# EAGLE design outdoor (EAGLE 9.1.3)
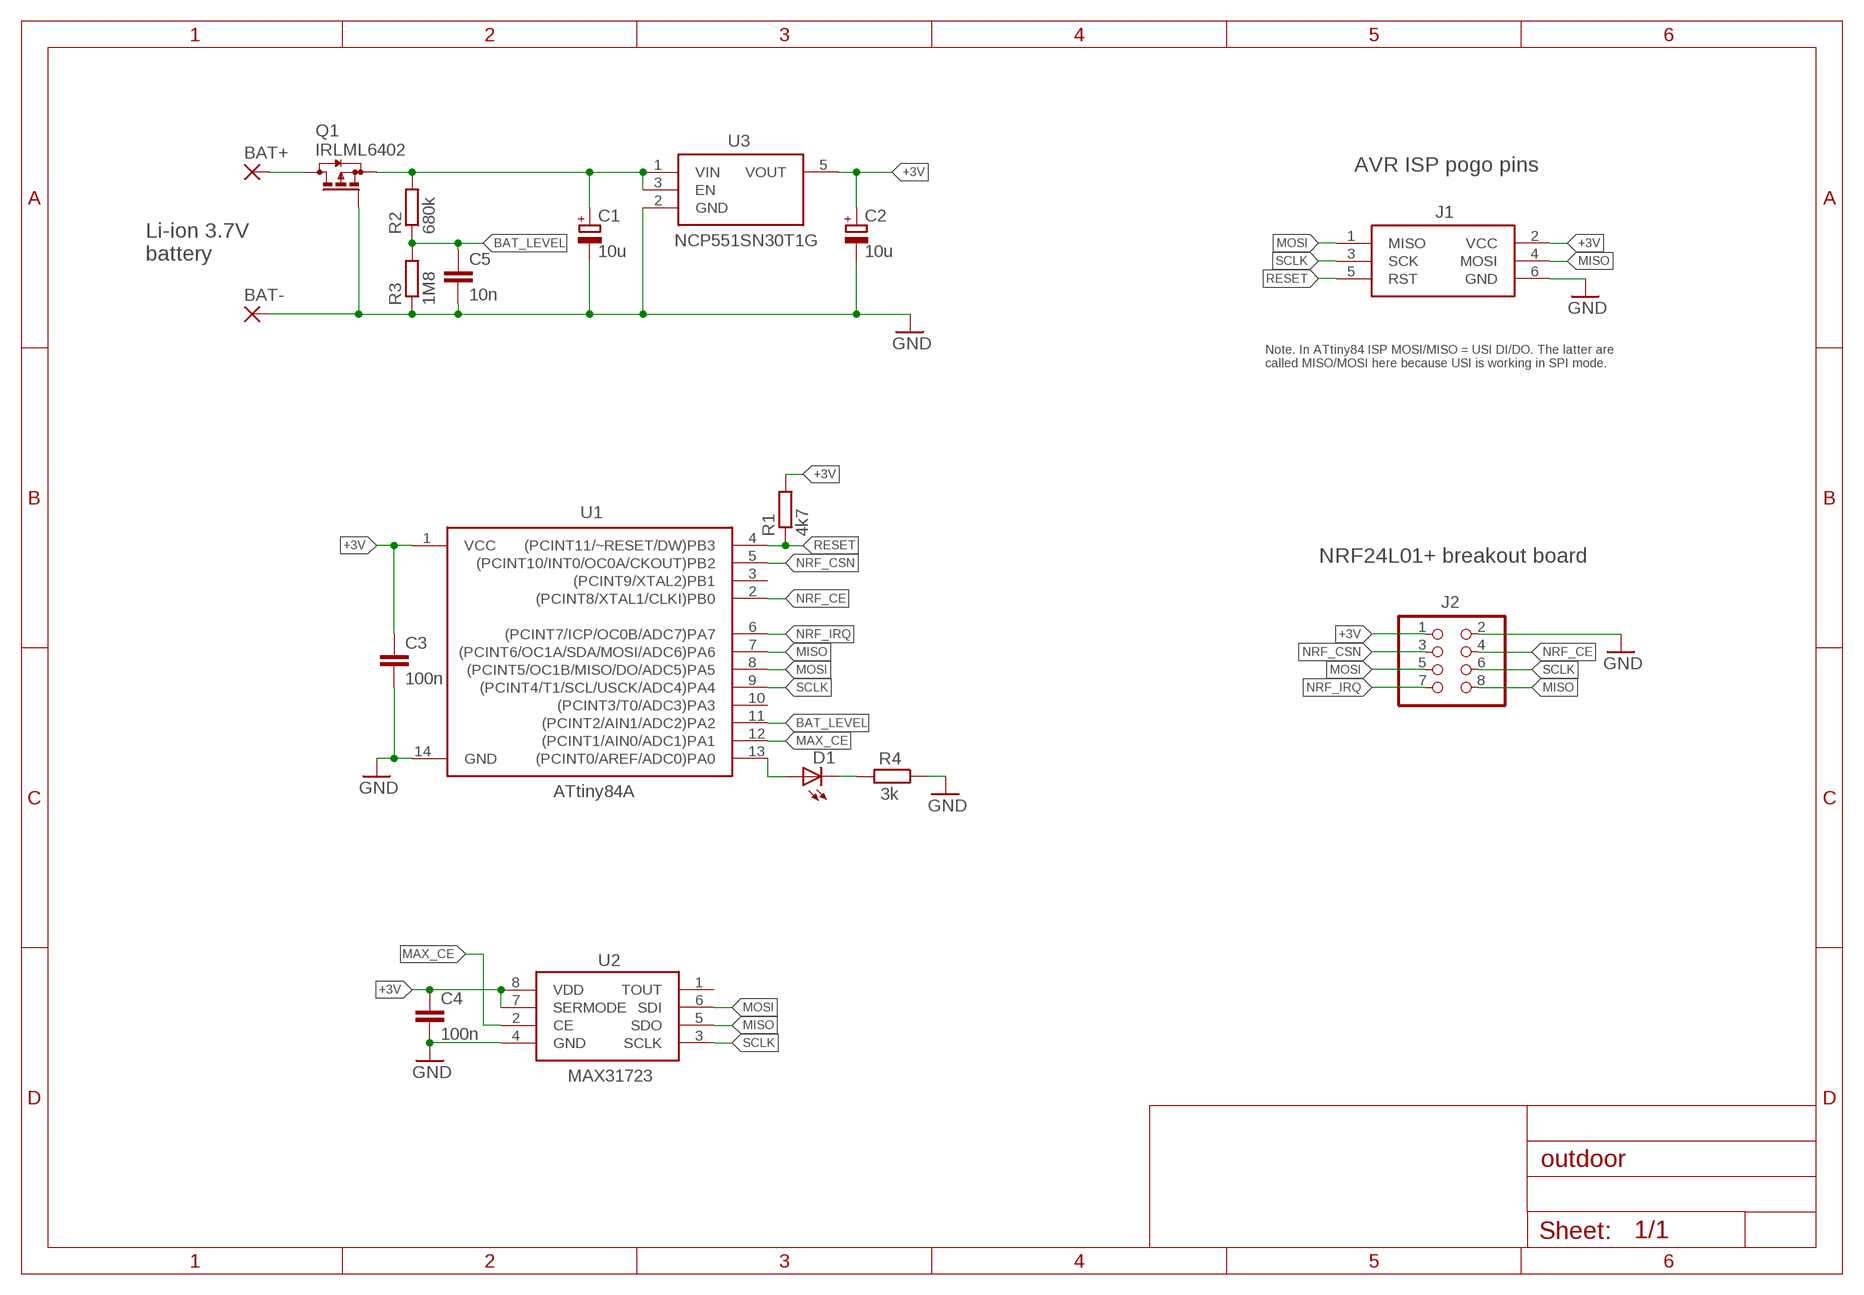
[diagram p0: schematic, sheet 1]

## Parts
BAT+  2,54/1,0  [2,54/1,0]
BAT-  2,54/1,0  [2,54/1,0]
C1  10u  CPOL-EUCT3216  [CT3216]
C2  10u  CPOL-EUCT3216  [CT3216]
C3  100n  C-EUC0805  [C0805]
C4  100n  C-EUC0805  [C0805]
C5  10n  C-EUC0805  [C0805]
D1  LEDSMT1206  [1206]
J1  POGO_AVR_ISP6  [POGO_AVR_ISP6]
J2  PINHD-2X4  [2X04]
Q1  IRLML6402  BSS84  [SOT23]
R1  4k7  R-EU_R0805  [R0805]
R2  680k  R-EU_R0805  [R0805]
R3  1M8  R-EU_R0805  [R0805]
R4  3k  R-EU_R0805  [R0805]
U1  ATtiny84A  ATTINY84  [SO14]
U2  MAX31723  MAX31722  [UMAX8]
U3  NCP551SN30T1G  NCP551  [SOT23-5]

## Nets
+3V: C2.+ C3.1 C4.1 J1.2(VCC) J2.1 R1.2 U1.1(VCC) U2.7(SERMODE) U2.8(VDD) U3.5(VOUT)
BAT_LEVEL: C5.1 R2.1 R3.2 U1.11((PCINT2/AIN1/ADC2)PA2)
GND: BAT-.1(P) C1.- C2.- C3.2 C4.2 C5.2 J1.6(GND) J2.2 Q1.1(G) R3.1 R4.1 U1.14(GND) U2.4(GND) U3.2(GND)
MAX_CE: U1.12((PCINT1/AIN0/ADC1)PA1) U2.2(CE)
MISO: J1.4(MOSI) J2.8 U1.7((PCINT6/OC1A/SDA/MOSI/ADC6)PA6) U2.5(SDO)
MOSI: J1.1(MISO) J2.5 U1.8((PCINT5/OC1B/MISO/DO/ADC5)PA5) U2.6(SDI)
N$1: BAT+.1(P) Q1.3(D)
N$2: C1.+ Q1.2(S) R2.2 U3.1(VIN) U3.3(EN)
N$3: D1.A U1.13((PCINT0/AREF/ADC0)PA0)
N$4: D1.C R4.2
NRF_CE: J2.4 U1.2((PCINT8/XTAL1/CLKI)PB0)
NRF_CSN: J2.3 U1.5((PCINT10/INT0/OC0A/CKOUT)PB2)
NRF_IRQ: J2.7 U1.6((PCINT7/ICP/OC0B/ADC7)PA7)
RESET: J1.5(RST) R1.1 U1.4((PCINT11/~RESET/DW)PB3)
SCLK: J1.3(SCK) J2.6 U1.9((PCINT4/T1/SCL/USCK/ADC4)PA4) U2.3(SCLK)
Unconnected: U1.3((PCINT9/XTAL2)PB1) U1.10((PCINT3/T0/ADC3)PA3) U2.1(TOUT)

## Notes on the sheet
- AVR ISP pogo pins
- Li-ion 3.7V
  battery
- Note. In ATtiny84 ISP MOSI/MISO = USI DI/DO. The latter are
  called MISO/MOSI here because USI is working in SPI mode.
- NRF24L01+ breakout board

## Library data of the parts
BAT+ BAT- = wirepad:2,54/1,0: THROUGH-HOLE PAD
C1 C2 = rcl:CPOL-EU: POLARIZED CAPACITOR, European symbol; SPICEPREFIX: C
C3-C5 = rcl:C-EU: CAPACITOR, European symbol; SPICEPREFIX: C
D1 = led:LED: LED OSRAM: - CHIPLED LG R971, LG N971, LY N971, LG Q971, LY Q971, LO R971, LY R971 LH N974, LH R974 LS Q976, LO Q976, LY Q976 LO Q996 - Hyper CHIPLED LW Q18S LB Q993, LB Q99A, LB R99A - SideLED LS A670, LO A670, LY A670, LG A670, LP A670 LB A673, LV A673, LT A673, LW A673 LH A674 LY A675 LS A676, LA A676, LO A676, LY A676, LW A676 LS A679, LY A679, LG A679 - Hyper Micro SIDELED® LS Y876, LA Y876, LO Y876, LY Y876 LT Y87S - SmartLED LW L88C, LW L88S LB L89C, LB L89S, LG L890 LS L89K, LO L89K, LY L89K LS L896, LA L896, LO L896, LY L896 - TOPLED LS T670, LO T670, LY T670, LG T670, LP T670 LSG T670, LSP T670, LSY T670, LOP T670, LYG T670 LG T671, LOG T671, LSG T671 LB T673, LV T673, LT T673, LW T673 LH T674 LS T676, LA T676, LO T676, LY T676, LB T676, LH T676, LSB T676, LW T676 LB T67C, LV T67C, LT T67C, LS T67K, LO T67K, LY T67K, LW E67C LS E67B, LA E67B, LO E67B, LY E67B, LB E67C, LV E67C, LT E67C LW T67C LS T679, LY T679, LG T679 LS T770, LO T770, LY T770, LG T770, LP T770 LB T773, LV T773, LT T773, LW T773 LH T774 LS E675, LA E675, LY E675, LS T675 LS T776, LA T776, LO T776, LY T776, LB T776 LHGB T686 LT T68C, LB T68C - Hyper Mini TOPLED® LB M676 - Mini TOPLED Santana® LG M470 LS M47K, LO M47K, LY M47K Source: http://www.osram.convergy.de LUXEON: - LUMILED® LXK2-PW12-R00, LXK2-PW12-S00, LXK2-PW14-U00, LXK2-PW14-V00 LXK2-PM12-R00, LXK2-PM12-S00, LXK2-PM14-U00 LXK2-PE12-Q00, LXK2-PE12-R00, LXK2-PE12-S00, LXK2-PE14-T00, LXK2-PE14-U00 LXK2-PB12-K00, LXK2-PB12-L00, LXK2-PB12-M00, LXK2-PB14-N00, LXK2-PB14-P00, LXK2-PB14-Q00 LXK2-PR12-L00, LXK2-PR12-M00, LXK2-PR14-Q00, LXK2-PR14-R00 LXK2-PD12-Q00, LXK2-PD12-R00, LXK2-PD12-S00 LXK2-PH12-R00, LXK2-PH12-S00 LXK2-PL12-P00, LXK2-PL12-Q00, LXK2-PL12-R00 Source: www.luxeon.com KINGBRIGHT: KA-3528ASYC Source: www.kingbright.com
J1 = my:POGO_AVR_ISP6
J2 = pinhead:PINHD-2X4: PIN HEADER
Q1 = transistor-small-signal:BSS84: P-CHANNEL MOS FET
R1-R4 = rcl:R-EU_: RESISTOR, European symbol; SPICEPREFIX: R
U1 = SparkFun-IC-Microcontroller:ATTINY84: Atmel 14-pin 2/4/8kB flash uC Datasheet <https://cdn.sparkfun.com/datasheets/Widgets/doc8006.pdf> SparkFun Products Tiny AVR Programmer <https://www.sparkfun.com/products/11801> (PGM-11801) SparkFun Servo Trigger - Continuous Rotation <https://www.sparkfun.com/products/13872> (WIG-13872) SparkFun Servo Trigger <https://www.sparkfun.com/products/13118> (WIG-13118); PROD_ID: IC-11285; VALUE: ATTINY84
U2 = my:MAX31722
U3 = my:NCP551

## Board
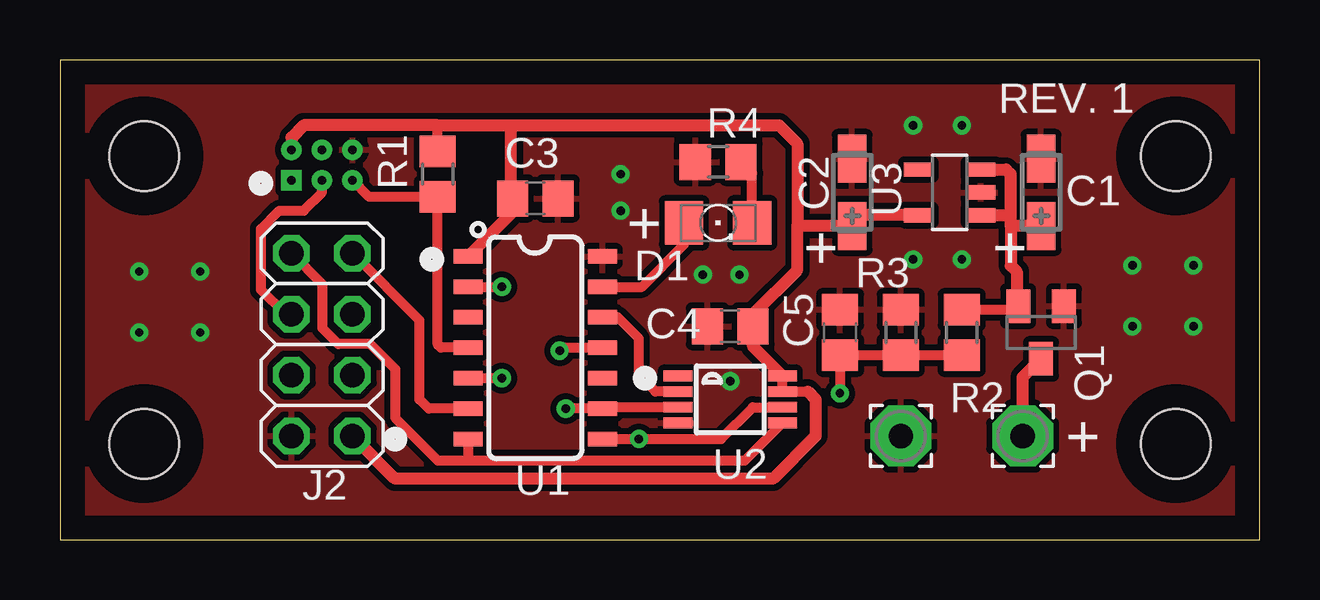
[diagram p1: board, top side]
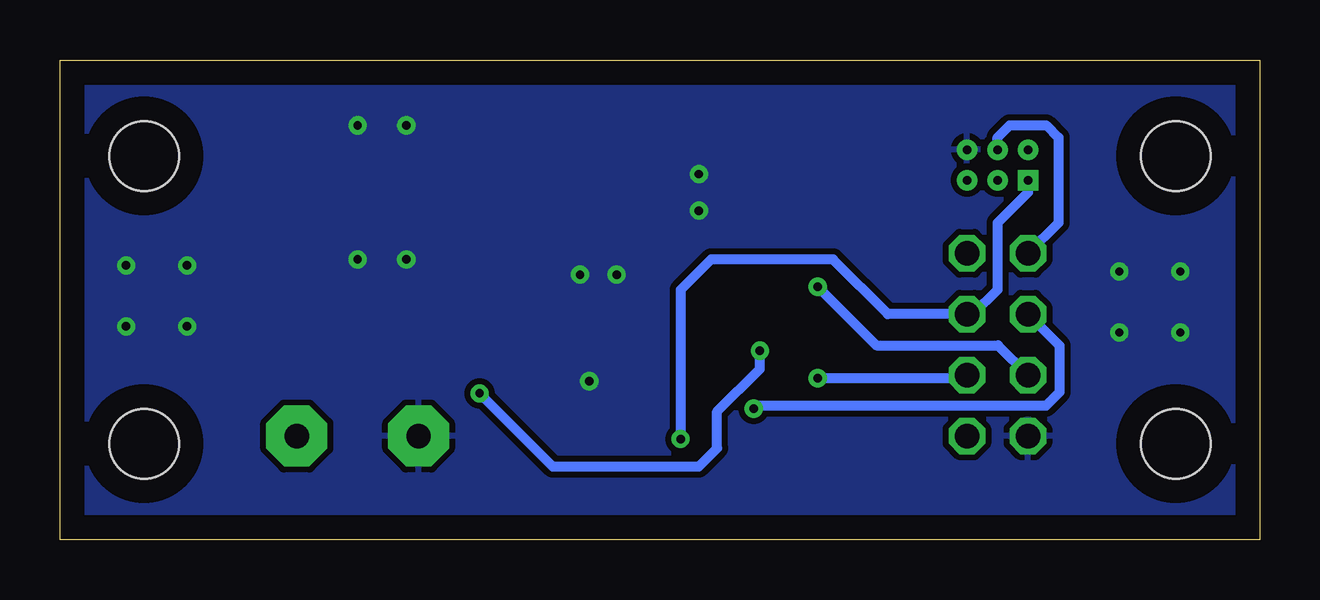
[diagram p2: board, bottom side, seen from below]

Size 50 x 20 mm. Coordinates in mm from the lower left corner, seen from the top.
Outline: 0,0 50,0 50,20 0,20 0,0
Copper layers (1*16): Top 0.035mm / dielectric 1.5mm / Bottom 0.035mm
Design rules "default": minimum track width 6mil, minimum drill 0.35mm, track to track 6mil, track to pad 6mil, pad to pad 6mil, via to via 6mil, smd to smd 6mil, copper to edge 40mil, drill to drill 6mil, minimum pad ring 10mil, minimum via ring 8mil, stop-mask expansion 4mil, vias tented up to drill 0mil, thermal gap 10mil
Holes 2.9 mm at 3.5,4 3.5,16 46.5,4 46.5,16

### Footprints (pad centres in the part's own frame; a part is rotated, then mirrored left to right if it is on the bottom)
2,54/1,0 = drill 1.016 pad 2.54 octagon: 1 0,0
CT3216 = smd 2 x 1.2: + -1.4,0; - 1.4,0
C0805 = smd 1.3 x 1.5: 1 -0.95,0; 2 0.95,0
1206 = smd 1.6 x 1.803: A -1.422,0; C 1.422,0
POGO_AVR_ISP6 = drill 0.35 square: 1 0,0 | drill 0.35: 2 1.27,0; 3 0,-1.27; 4 1.27,-1.27; 5 0,-2.54; 6 1.27,-2.54
2X04 = drill 1.016 octagon: 1 -3.81,-1.27; 2 -3.81,1.27; 3 -1.27,-1.27; 4 -1.27,1.27; 5 1.27,-1.27; 6 1.27,1.27; 7 3.81,-1.27; 8 3.81,1.27
SOT23 = smd 1 x 1.4: 1 -0.95,-1.1; 2 0.95,-1.1; 3 0,1.1
R0805 = smd 1.3 x 1.5: 1 -0.95,0; 2 0.95,0
SO14 = smd 0.6 x 1.2: 1 -3.175,-2.8; 2 -1.905,-2.8; 3 -0.635,-2.8; 4 0.635,-2.8; 5 1.905,-2.8; 6 3.175,-2.8; 7 4.445,-2.8; 8 4.445,2.8; 9 3.175,2.8; 10 1.905,2.8; 11 0.635,2.8; 12 -0.635,2.8; 13 -1.905,2.8; 14 -3.175,2.8
UMAX8 = smd 0.45 x 1.2: 1 -0.975,-2.175; 2 -0.325,-2.175; 3 0.325,-2.175; 4 0.975,-2.175; 5 0.975,2.175; 6 0.325,2.175; 7 -0.325,2.175; 8 -0.975,2.175
SOT23-5 = smd 0.6 x 1.2: 1 -0.95,-1.306; 2 0,-1.306; 3 0.95,-1.306; 4 0.95,1.306; 5 -0.95,1.306

### Placement (x,y rotation side)
BAT+  40.13,4.32 90 top
BAT-  35.05,4.32 90 top
C1  40.89,14.48 90 top
C2  33.02,14.48 90 top
C3  19.81,14.22 0 top
C4  27.94,8.89 180 top
C5  32.51,8.64 90 top
D1  27.43,13.21 0 top
J1  9.65,14.99 90 top
J2  10.92,8.13 90 top
Q1  40.89,8.64 180 top
R1  15.75,15.24 90 top
R2  37.59,8.64 90 top
R3  35.05,8.64 270 top
R4  27.43,15.75 0 top
U1  19.81,8.64 270 top
U2  27.94,5.84 270 top
U3  37.08,14.48 90 top

### Tracks (layer width: path | path; a pad name or v marks a point on that pad's centre or on a via)
+3V
  Top 0.406: U2.8 U2.7 31.17,6.17 | 30.74,13.08 30.73,13.08 | R1.2 15.75,17.27 | 18.86,13.66 C3.1 18.8,14.29 | C4.1 28.89,9.4
  Top 0.508: U3.5 33.47,13.53 C2.+ 30.74,13.08 | 18.8,17.27 15.75,17.27 10.16,17.27 9.65,16.76 J1.2 | 18.8,17.27 29.97,17.27 30.73,16.51 30.73,13.08 30.73,11.24 28.89,9.4 | 31.17,6.17 31.5,5.84 31.5,4.32 29.72,2.54 13.97,2.54 J2.1 | U1.1 18.86,13.66 | 18.8,14.29 18.8,17.27 | U2.8 28.89,8.04 C4.1
BAT_LEVEL  (via drill 0.35)
  Top 0.406: R2.1 R3.2 C5.1 v32.51,6.1 | v20.83,7.87 20.95,8 U1.11
  Bottom 0.406: v32.51,6.1 29.46,3.05 23.37,3.05 22.61,3.81 22.61,5.33 20.83,7.11 v20.83,7.87
GND  (via drill 0.35)
  other vias: 23.37,15.24 26.8,11.05 37.59,11.68 37.59,17.27 27.94,6.6 3.3,11.18 5.84,11.18 3.3,8.64 5.84,8.64 35.56,11.68 44.7,11.43 47.24,11.43 44.7,8.89 47.24,8.89 35.56,17.27 23.37,13.72 28.32,11.05
  pour Top (isolate 0.254): 0,0 50,0 50,20 0,20
  pour Bottom (isolate 0.254): 0,0 50,0 50,20 0,20
MAX_CE
  Top 0.406: U2.2 24.82,6.17 24.13,6.86 24.13,8.38 23.24,9.27 U1.12
MISO
  Top 0.406: U2.5 28.55,3.3 17.02,3.3 | J2.8 10.95,10.64 10.95,8.81 11.6,8.15 12.93,8.15 13.97,7.11 13.97,5.08 15.75,3.3 17.02,3.3 | U1.7 17.02,3.3
  Bottom 0.406: J1.4 10.92,16.76 10.41,17.27 8.89,17.27 8.38,16.76 8.38,13.21 J2.8
MOSI  (via drill 0.35)
  Top 0.406: U1.8 v24.13,4.19 27.56,4.19 28.89,5.52 U2.6
  Bottom 0.406: J1.1 9.65,14.48 10.92,13.21 10.92,10.41 11.94,9.4 J2.5 15.49,9.4 17.78,11.68 22.86,11.68 24.13,10.41 v24.13,4.19
N$1
  Top 0.508: BAT+.1 40.13,6.77 Q1.3
N$2
  Top 0.406: 39.56,13.53 39.62,13.46 | 39.63,13.08 39.62,13.08 | R2.2 39.12,9.59 39.79,9.59 Q1.2 39.88,9.8
  Top 0.508: U3.3 39.44,15.43 39.62,15.24 39.62,13.46 39.62,13.08 | U3.1 39.56,13.53 | C1.+ 39.63,13.08 39.63,11.43 39.88,11.18 39.88,9.8
N$3
  Top 0.406: U1.13 24.26,10.54 26.01,12.29 D1.A
N$4
  Top 0.406: D1.C 28.85,15.28 R4.2
NRF_CE  (via drill 0.35)
  Top 0.406: U1.2 v18.41,10.54
  Bottom 0.406: v18.41,10.54 15.98,8.1 10.9,8.1 J2.4
NRF_CSN  (via drill 0.35)
  Top 0.406: U1.5 v18.41,6.73
  Bottom 0.406: v18.41,6.73 12.32,6.73 J2.3
NRF_IRQ
  Top 0.406: U1.6 15.37,5.46 14.99,5.84 14.99,9.14 J2.7
RESET
  Top 0.406: U1.4 15.88,8 15.75,8.13 R1.1 12.89,14.29 J1.5
SCLK  (via drill 0.35)
  Top 0.406: U2.3 22.67,5.52 U1.9 v21.08,5.46 | J2.6 9.4,9.4 8.38,10.41 8.38,12.95 9.14,13.72 10.16,13.72 10.92,14.48 J1.3
  Bottom 0.406: J2.6 8.33,8.08 8.33,6.15 8.89,5.59 20.95,5.59 v21.08,5.46

### Text on the board
tNames: REV. 1 | + | + | + | +